# Altium schematic sheet Reciever.SchDoc
size A4; SheetNumber: 7
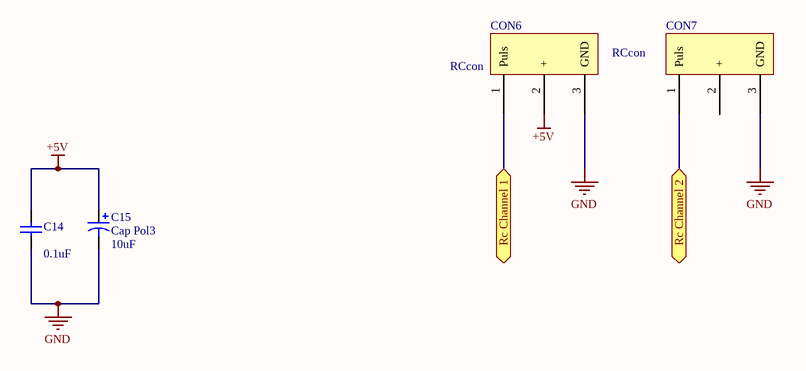
[diagram p0: Reciever.SchDoc]

## Parts
C14  value 0.1uF  [C1206]  (hidden comment: Cap Semi)
C15  Cap Pol3  value 10uF  [C0805]
CON6  RCcon  [RcCon]
CON7  RCcon  [RcCon]

## Ports
Rc Channel 1, Rc Channel 2

## Nets
+5V: C14.1 C15.1 CON6.2(+)
GND: C14.2 C15.2 CON6.3(GND) CON7.3(GND)
Rc Channel 1: CON6.1(Puls) ; port Rc Channel 1
Rc Channel 2: CON7.1(Puls) ; port Rc Channel 2

Not connected (* = marked no-connect by the designer): CON7 2(+)

## Library data of the parts
C14 = Cap Semi: Capacitor (Semiconductor SIM Model); Published: 8-Jun-2000; LatestRevisionDate: 29-May-2009; LatestRevisionNote: IPC-7351 Footprint Added.; PackageReference: C1206; Publisher: Altium Limited; PackageDescription: Chip Capacitor
C15 = Cap Pol3: Polarized Capacitor (Surface Mount); Published: 8-Jun-2000; LatestRevisionDate: 29-May-2009; LatestRevisionNote: IPC-7351 Footprint Added.; PackageReference: C0805; Publisher: Altium Limited; PackageDescription: Chip Capacitor
CON6 CON7 = Rc con